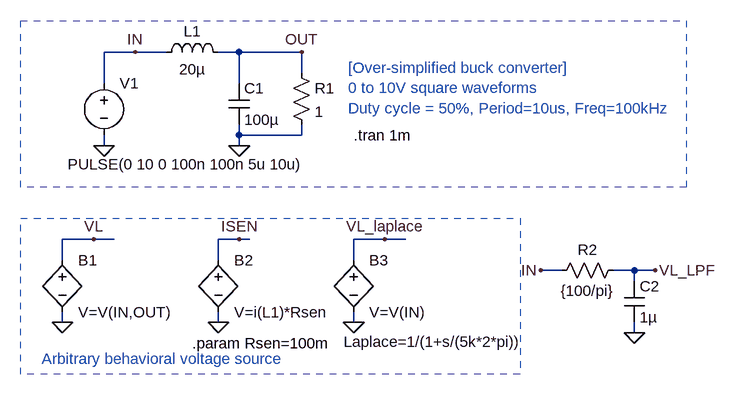
[diagram p0: schematic 06-ArbitraryVoltageSource_OverSimplifiedBuck.asc]
06-ArbitraryVoltageSource_OverSimplifiedBuck.asc, the LTspice schematic file:
Version 4
SHEET 1 1564 680
WIRE 656 -208 608 -208
WIRE 704 -208 656 -208
WIRE 816 -208 784 -208
WIRE 912 -208 816 -208
WIRE 912 -176 912 -208
WIRE 608 -160 608 -208
WIRE 816 -160 816 -208
WIRE 816 -80 816 -96
WIRE 912 -80 912 -96
WIRE 912 -80 816 -80
WIRE 608 -64 608 -80
WIRE 816 -64 816 -80
WIRE 592 80 544 80
WIRE 624 80 592 80
WIRE 816 80 784 80
WIRE 832 80 816 80
WIRE 1040 80 992 80
WIRE 1072 80 1040 80
WIRE 544 112 544 80
WIRE 784 112 784 80
WIRE 992 112 992 80
WIRE 1312 128 1280 128
WIRE 1424 128 1392 128
WIRE 1456 128 1424 128
WIRE 1424 144 1424 128
WIRE 544 208 544 192
WIRE 784 208 784 192
WIRE 992 208 992 192
WIRE 1424 224 1424 208
FLAG 608 -64 0
FLAG 816 -64 0
FLAG 656 -208 IN
FLAG 912 -208 OUT
FLAG 544 208 0
FLAG 592 80 VL
FLAG 784 208 0
FLAG 816 80 ISEN
FLAG 992 208 0
FLAG 1040 80 VL_laplace
FLAG 1424 224 0
FLAG 1280 128 IN
FLAG 1456 128 VL_LPF
SYMBOL voltage 608 -176 R0
WINDOW 3 -56 141 Left 2
WINDOW 123 0 0 Left 2
WINDOW 39 0 0 Left 2
SYMATTR Value PULSE(0 10 0 100n 100n 5u 10u)
SYMATTR InstName V1
SYMBOL ind 688 -192 R270
WINDOW 0 32 56 VTop 2
WINDOW 3 5 56 VBottom 2
SYMATTR InstName L1
SYMATTR Value 20µ
SYMBOL cap 800 -160 R0
SYMATTR InstName C1
SYMATTR Value 100µ
SYMBOL res 896 -192 R0
SYMATTR InstName R1
SYMATTR Value 1
SYMBOL bv 544 96 R0
SYMATTR InstName B1
SYMATTR Value V=V(IN,OUT)
SYMBOL bv 784 96 R0
SYMATTR InstName B2
SYMATTR Value V=i(L1)*Rsen
SYMBOL bv 992 96 R0
WINDOW 123 -15 142 Left 2
SYMATTR Value2 Laplace=1/(1+s/(5k*2*pi))
SYMATTR InstName B3
SYMATTR Value V=V(IN)
SYMBOL res 1408 112 R90
WINDOW 0 0 56 VBottom 2
WINDOW 3 32 56 VTop 2
SYMATTR InstName R2
SYMATTR Value {100/pi}
SYMBOL cap 1408 144 R0
SYMATTR InstName C2
SYMATTR Value 1µ
TEXT 992 -80 Left 2 !.tran 1m
TEXT 984 -184 Left 2 ;[Over-simplified buck converter]\n0 to 10V square waveforms\nDuty cycle = 50%, Period=10us, Freq=100kHz
TEXT 512 264 Left 2 ;Arbitrary behavioral voltage source
TEXT 744 240 Left 2 !.param Rsen=100m
RECTANGLE Normal 1504 0 480 -256 2
RECTANGLE Normal 1248 288 480 48 2

The netlist it stands for:
* 06-ArbitraryVoltageSource_OverSimplifiedBuck.asc
V1 IN 0 PULSE(0 10 0 100n 100n 5u 10u)
L1 IN OUT 20µ
C1 OUT 0 100µ
R1 OUT 0 1
B1 VL 0 V=V(IN,OUT)
B2 ISEN 0 V=i(L1)*Rsen
B3 VL_laplace 0 V=V(IN) Laplace=1/(1+s/(5k*2*pi))
R2 VL_LPF IN {100/pi}
C2 VL_LPF 0 1µ
.tran 1m
* [Over-simplified buck converter]
* 0 to 10V square waveforms
* Duty cycle = 50%, Period=10us, Freq=100kHz
* Arbitrary behavioral voltage source
.param Rsen=100m
.backanno
.end